# EAGLE design controlerV2 (EAGLE 8.6.3)
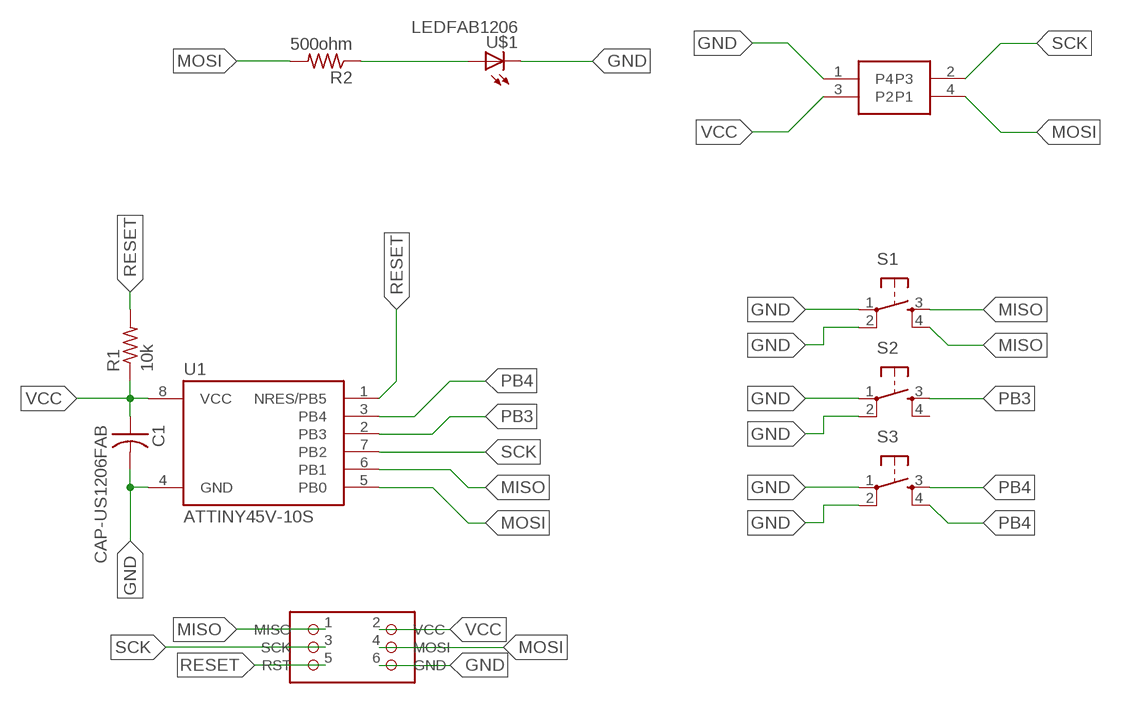
[diagram p0: schematic, sheet 1]

## Parts
C1  CAP-US1206FAB  [C1206FAB]
R1  10k  R-US_R1206  [R1206]
R2  500ohm  RES-US1206FAB  [R1206FAB]
S1  6MM_SWITCH6MM_SWITCH  [6MM_SWITCH]
S2  6MM_SWITCH6MM_SWITCH  [6MM_SWITCH]
S3  6MM_SWITCH6MM_SWITCH  [6MM_SWITCH]
U1  ATTINY45V-10S  [SOIC8_EIAJ_208MIL]
U$1  LEDFAB1206  [LED1206FAB]
U$2  4PIN-SMD-CONNECTOR  [2X02SMD]
U$4  AVRISPSMD  [2X03SMD]

## Nets
GND: C1.2 S1.1(P) S1.2(P1) S2.1(P) S2.2(P1) S3.1(P) S3.2(P1) U1.4(GND) U$1.2(C) U$2.1(P4) U$4.6(GND)
MISO: S1.3(S) S1.4(S1) U1.6(PB1) U$4.1(MISO)
MOSI: R2.2 U1.5(PB0) U$2.4(P1) U$4.4(MOSI)
N$1: R2.1 U$1.1(A)
PB3: S2.3(S) U1.2(PB3)
PB4: S3.3(S) S3.4(S1) U1.3(PB4)
RESET: R1.2 U1.1(NRES/PB5) U$4.5(RST)
SCK: U1.7(PB2) U$2.2(P3) U$4.3(SCK)
VCC: C1.1 R1.1 U1.8(VCC) U$2.3(P2) U$4.2(VCC)
Unconnected: S2.4(S1)

## Library data of the parts
C1 = fab:CAP-US
R1 = resistor:R-US_: RESISTOR, American symbol
R2 = fab:RES-US: Resistor (US Symbol) Variants with postfix FAB are widened to allow the routing of internal traces
S1-S3 = fab:6MM_SWITCH: OMRON SWITCH
U1 = _hhn_attiny25_45_85:ATTINY45*: ATMEL ATtiny 45 Packages: P = PDIP 08 30mil S = SOIC 08 EIAJ 208mil X = TSSOP 08 4.4mm Technologies Note: for complete ordering code (temp. range, finish, tape&reel etc.) see www.atmel.com • Supply Voltage: V = (1.8…5.5)V | [blank] = (2.7…5.5)V • Speed: 10 = 10 MHz | 20 = 20 MHz Author: Dipl.-Ing. FH Rainer Bayer HHN Hochschule Heilbronn (Heilbronn University), rainer.bayer@hs-heilbronn.de Ingenieurbüro ing-rb, mail@ing-rb.de
U$1 = fab:LED: LED
U$2 = fab:4PIN-SMD-CONNECTOR
U$4 = fab:AVRISP

## Board
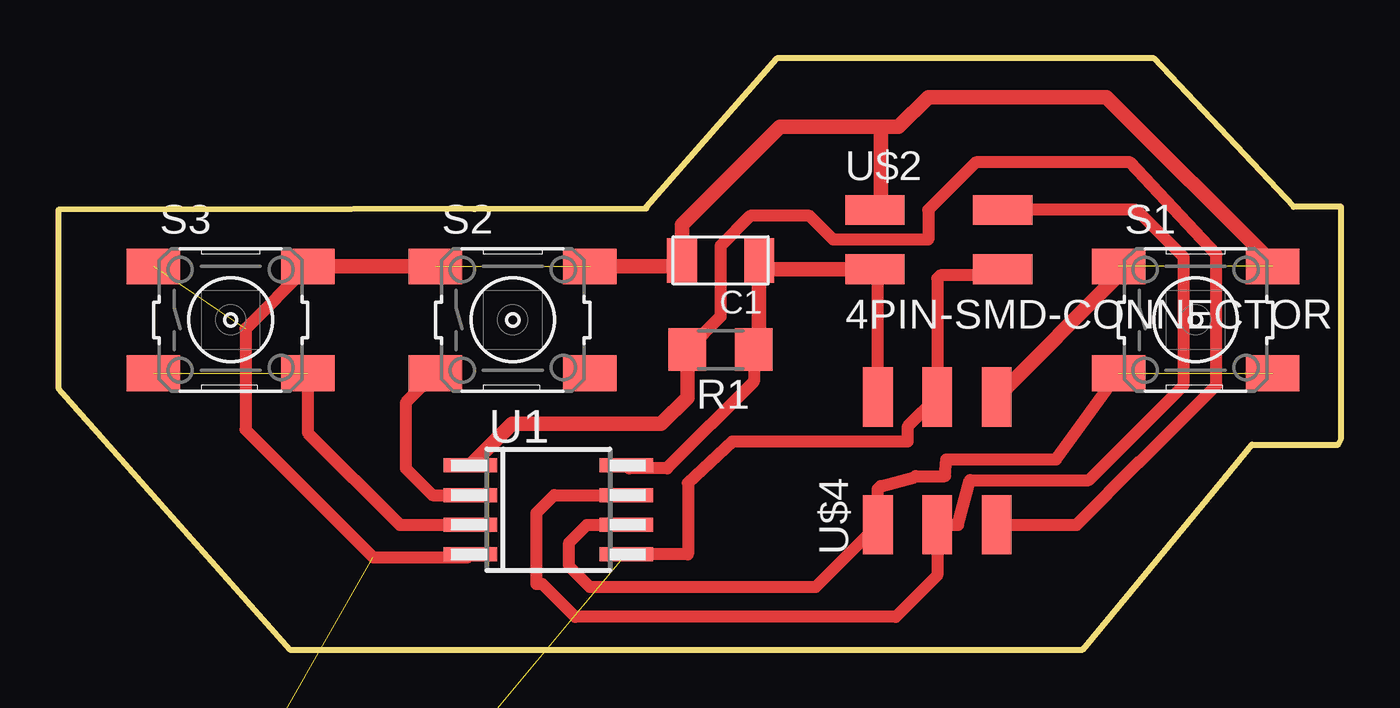
[diagram p1: board, top side]

Size 54.86 x 25.27 mm. Coordinates in mm from the lower left corner, seen from the top.
Outline: 25.15,18.92 30.73,25.27 46.86,25.27 52.83,18.92 54.86,18.92 54.86,9.02 54.74,8.76 51.05,8.76 49.91,7.37 43.81,0 9.91,0 0,11.18 0,18.8 25.15,18.85
Copper layers (1*16): Top 0.035mm / dielectric 1.5mm / Bottom 0.035mm
Design rules "default": minimum track width 6mil, minimum drill 0.35mm, track to track 6mil, track to pad 6mil, pad to pad 6mil, via to via 6mil, smd to smd 6mil, copper to edge 40mil, drill to drill 6mil, minimum pad ring 10mil, minimum via ring 8mil, stop-mask expansion 4mil, vias tented up to drill 0mil, thermal gap 10mil

### Footprints (pad centres in the part's own frame; a part is rotated, then mirrored left to right if it is on the bottom)
C1206FAB = smd 1.27 x 1.905: 1 -1.651,0; 2 1.651,0
R1206 = smd 1.6 x 1.803: 1 -1.422,0; 2 1.422,0
R1206FAB = smd 1.27 x 1.905: 1 -1.651,0; 2 1.651,0
6MM_SWITCH = smd 2.286 x 1.524: 1 -3.302,2.286; 2 3.302,2.286; 3 -3.302,-2.286; 4 3.302,-2.286
SOIC8_EIAJ_208MIL = smd 0.6 x 2.286: 1 -1.905,-3.33; 2 -0.635,-3.33; 3 0.635,-3.33; 4 1.905,-3.33; 5 1.905,3.33; 6 0.635,3.33; 7 -0.635,3.33; 8 -1.905,3.33
LED1206FAB = smd 1.27 x 1.905: 1 -1.651,0; 2 1.651,0
2X02SMD = smd 2.54 x 1.27: 1 -2.54,1.27; 2 2.92,1.27; 3 -2.54,-1.27; 4 2.92,-1.27
2X03SMD = smd 2.54 x 1.27: 1 -2.54,2.54; 2 2.92,2.54; 3 -2.54,0; 4 2.92,0; 5 -2.54,-2.54; 6 2.92,-2.54

### Placement (x,y rotation side)
C1  28.32,16.64 180 top
R1  28.32,12.83 180 top
R2  0.13,-22.86 0 top  (outside the outline)
S1  48.64,14.1 0 top
S2  19.43,14.1 0 top
S3  7.37,14.1 0 top
U1  20.96,5.97 270 top
U$1  0.13,-16.51 0 top  (outside the outline)
U$2  37.46,17.53 0 top
U$4  37.59,7.87 90 top

### Tracks (layer width: path | path; a pad name or v marks a point on that pad's centre or on a via)
GND  (4 unrouted)
  Top 0.406: 26.42,16.38 C1.2 | 52.07,16.38 S1.2 52.2,16.64
  Top 0.508: S3.2 8,13.72 8,9.4 13.46,3.94 17.5,3.94 U1.4
  Top 0.61: S2.2 26.42,16.38 | 52.07,16.38 44.83,23.62 37.21,23.62 35.94,22.35 35.18,22.35 | S3.2 S2.1 | U$2.1 35.18,19.05 35.18,22.35 | U$4.6 45.34,16 S1.1 | C1.2 26.67,18.16 30.86,22.35 35.18,22.35
MISO  (1 unrouted)
  Top 0.508: S1.3 42.67,8.13 37.97,8.13 37.93,7.41 36.66,7.41 36.62,7.37 35.18,6.99 35.05,6.86 U$4.1 32.38,2.67 22.73,2.67 21.84,3.56 21.84,4.57 22.61,5.33 U1.6
MOSI  (1 unrouted)
  Top 0.508: U$2.4 40.13,16 37.72,16 37.59,15.88 U$4.4 36.32,9.52 36.32,8.89 28.83,8.89 26.92,7.11 26.92,4.06 U1.5
N$1  (1 unrouted)
PB3
  Top 0.508: S2.3 14.86,10.54 14.86,7.75 16,6.6 U1.2
PB4  (1 unrouted)
  Top 0.508: S3.4 10.67,9.27 14.61,5.33 U1.3
RESET
  Top 0.508: R1.2 28.32,14.25 28.32,17.27 29.59,18.54 32.13,18.54 33.15,17.53 37.21,17.53 37.21,18.8 39.24,20.83 45.85,20.83 49.53,16.89 49.53,11.3 46.23,8 46.21,8.02 46.24,8.02 43.55,5.33 U$4.5
  Top 0.61: R1.2 26.9,10.77 25.78,9.65 19.4,9.65 U1.1
SCK
  Top 0.508: U$2.2 46.1,18.8 48.13,16.76 48.13,11.3 44.07,7.24 38.99,7.24 38.48,5.33 U$4.3 37.59,3.17 35.81,1.4 22.1,1.4 20.7,2.79 20.45,2.79 20.45,5.84 21.21,6.6 U1.7
VCC
  Top 0.406: 29.59,16.64 C1.1
  Top 0.508: U$4.2 35.05,16.13 U$2.3 | R1.1 29.74,11.45 26.04,7.75 24.41,7.75 U1.8
  Top 0.61: U$2.3 30.35,16.26 C1.1 29.97,13.06 R1.1